# Altium project 7621_Project.PrjPCB
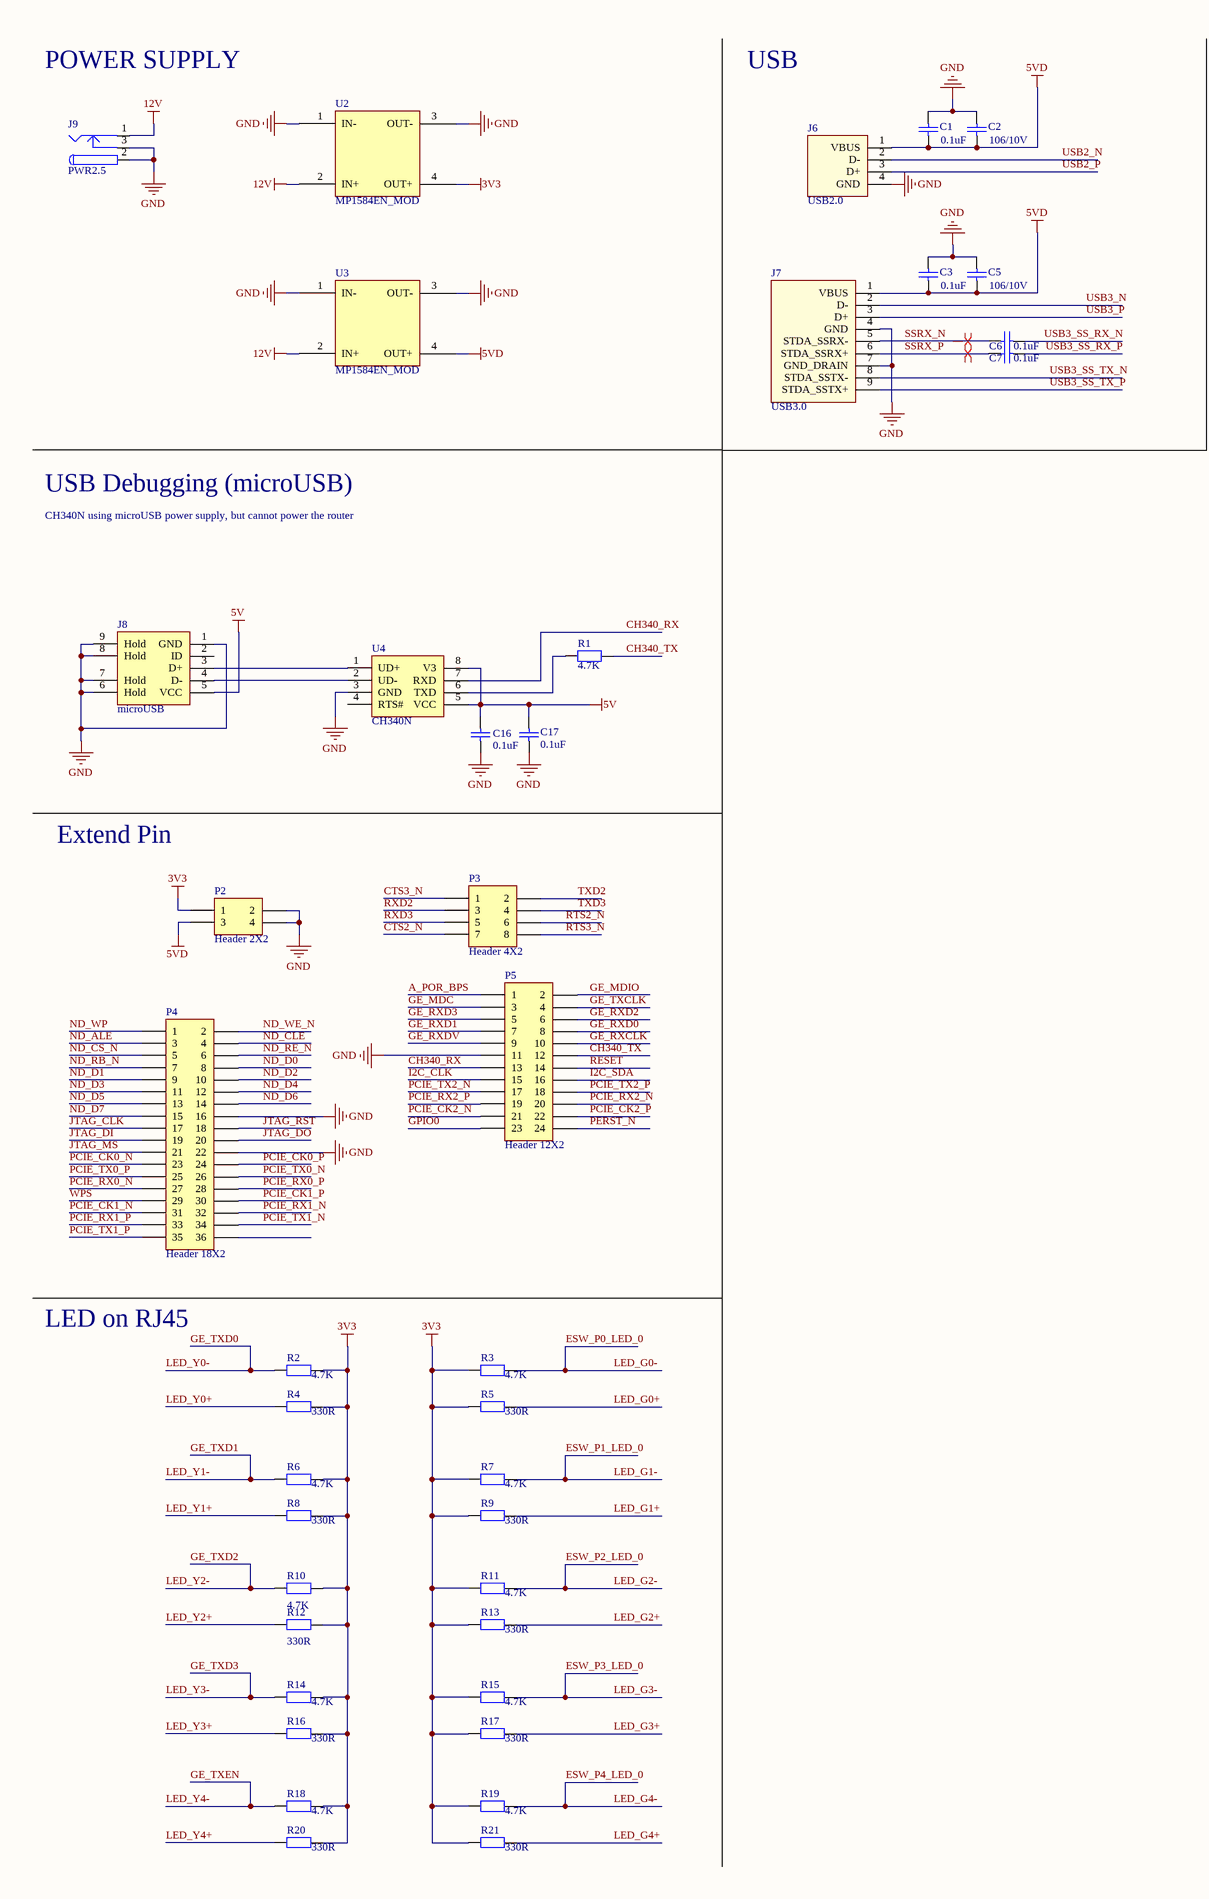
[diagram p0: Sheet.SchDoc, left]
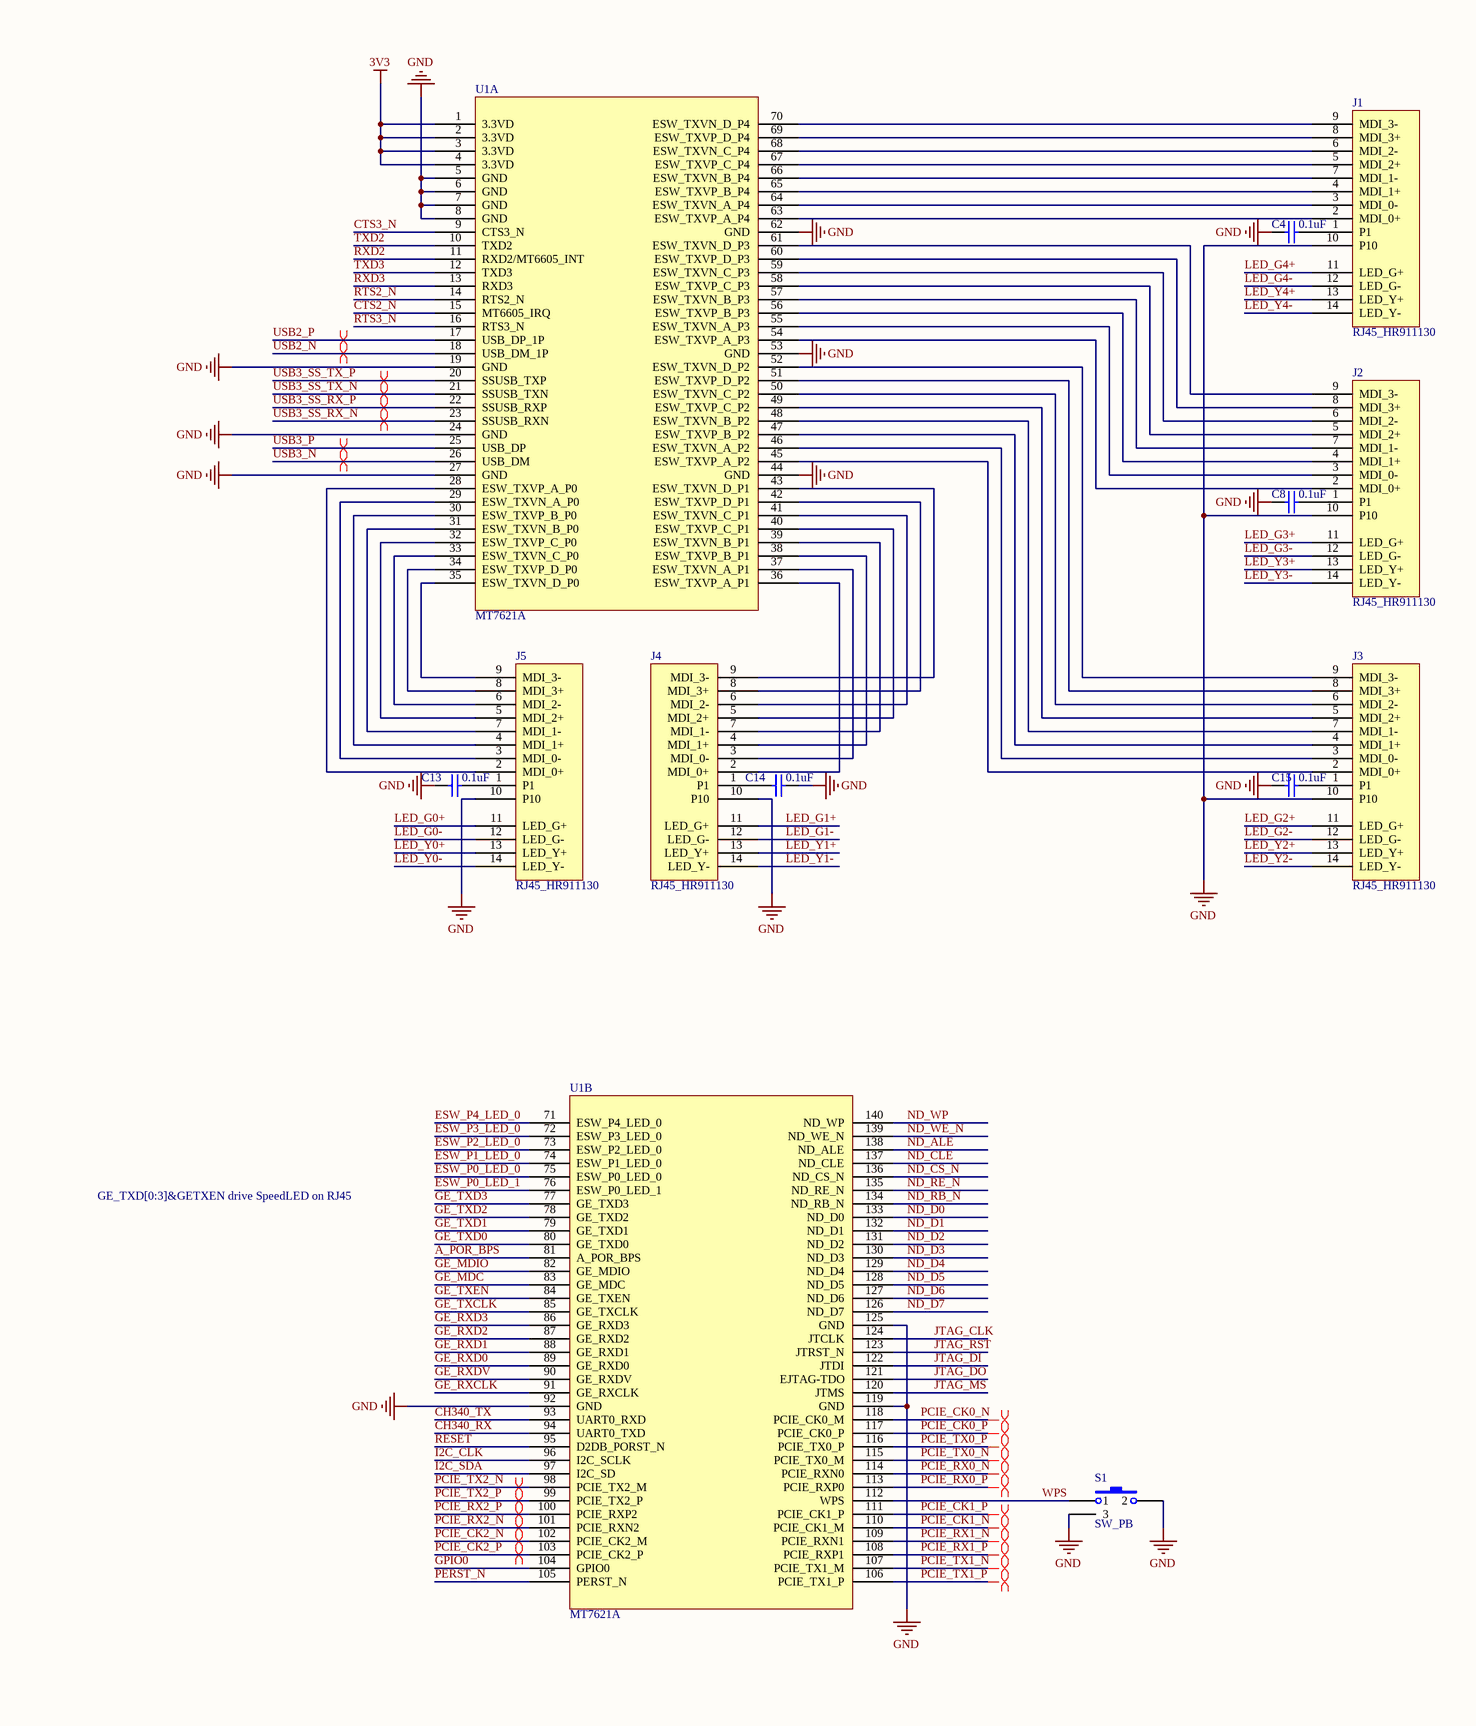
[diagram p1: Sheet.SchDoc, right]
1 sheet, 52 parts. Net scope: global (net labels, ports and power ports of the same name join across sheets).
Board file: PCB.PcbDoc

## Sheet Sheet.SchDoc
size A2

### Parts
C1  value 0.1uF  [6-0805]  (hidden comment: Cap)
C2  value 106/10V  [6-0805]  (hidden comment: Cap)
C3  value 0.1uF  [6-0805]  (hidden comment: Cap)
C4  value 0.1uF  [6-0805]  (hidden comment: Cap)
C5  value 106/10V  [6-0805]  (hidden comment: Cap)
C6  value 0.1uF  [3-0603]  (hidden comment: Cap)
C7  value 0.1uF  [3-0603]  (hidden comment: Cap)
C8  value 0.1uF  [6-0805]  (hidden comment: Cap)
C13  value 0.1uF  [6-0805]  (hidden comment: Cap)
C14  value 0.1uF  [6-0805]  (hidden comment: Cap)
C15  value 0.1uF  [6-0805]  (hidden comment: Cap)
C16  value 0.1uF  [6-0805]  (hidden comment: Cap)
C17  value 0.1uF  [6-0805]  (hidden comment: Cap)
J1  RJ45_HR911130  [RJ45_HR911130]
J2  RJ45_HR911130  [RJ45_HR911130]
J3  RJ45_HR911130  [RJ45_HR911130]
J4  RJ45_HR911130  [RJ45_HR911130]
J5  RJ45_HR911130  [RJ45_HR911130]
J6  USB2.0  [USB2.0]
J7  USB3.0  [USB3.0]
J8  microUSB  [MICROusb]
J9  PWR2.5  [CON\DC-JACK\4.7]
P2  Header 2X2  [HDR2X2]
P3  Header 4X2  [HDR2X4]
P4  Header 18X2  [HDR2X18]
P5  Header 12X2  [HDR2X12]
R1  value 4.7K  [6-0805]  (hidden comment: Res2)
R2  value 4.7K  [6-0805]  (hidden comment: Res2)
R3  value 4.7K  [6-0805]  (hidden comment: Res2)
R4  value 330R  [6-0805]  (hidden comment: Res2)
R5  value 330R  [6-0805]  (hidden comment: Res2)
R6  value 4.7K  [6-0805]  (hidden comment: Res2)
R7  value 4.7K  [6-0805]  (hidden comment: Res2)
R8  value 330R  [6-0805]  (hidden comment: Res2)
R9  value 330R  [6-0805]  (hidden comment: Res2)
R10  value 4.7K  [6-0805]  (hidden comment: Res2)
R11  value 4.7K  [6-0805]  (hidden comment: Res2)
R12  value 330R  [6-0805]  (hidden comment: Res2)
R13  value 330R  [6-0805]  (hidden comment: Res2)
R14  value 4.7K  [6-0805]  (hidden comment: Res2)
R15  value 4.7K  [6-0805]  (hidden comment: Res2)
R16  value 330R  [6-0805]  (hidden comment: Res2)
R17  value 330R  [6-0805]  (hidden comment: Res2)
R18  value 4.7K  [6-0805]  (hidden comment: Res2)
R19  value 4.7K  [6-0805]  (hidden comment: Res2)
R20  value 330R  [6-0805]  (hidden comment: Res2)
R21  value 330R  [6-0805]  (hidden comment: Res2)
S1  SW_PB  [SW_PB]
U1  MT7621A  [HLK-7621]  (parts A,B of 2)
U2  MP1584EN_MOD  [MP1584EN_MOD]
U3  MP1584EN_MOD  [MP1584EN_MOD]
U4  CH340N  [CH340N]

### Nets
3V3: P2.1 R2.2 R3.1 R4.2 R5.1 R6.2 R7.1 R8.2 R9.1 R10.2 R11.1 R12.2 R13.1 R14.2 R15.1 R16.2 R17.1 R18.2 R19.1 R20.2 R21.1 U1.1(3.3VD) U1.2(3.3VD) U1.3(3.3VD) U1.4(3.3VD) U2.4(OUT+)
5V: C16.2 C17.1 J8.5(VCC) U4.5(VCC) U4.8(V3)
5VD: C1.1 C2.1 C3.1 C5.1 J6.1(VBUS) J7.1(VBUS) P2.3 U3.4(OUT+)
12V: J9.1 U2.2(IN+) U3.2(IN+)
GND: C1.2 C2.2 C3.2 C4.2 C5.2 C8.2 C13.2 C14.1 C15.2 C16.1 C17.2 J1.10(P10) J2.10(P10) J3.10(P10) J4.10(P10) J5.10(P10) J6.4(GND) J7.4(GND) J7.7(GND_DRAIN) J8.1(GND) J8.6(Hold) J8.7(Hold) J8.8(Hold) J8.9(Hold) J9.2 J9.3 P2.2 P2.4 P4.16 P4.22 P5.11 S1.2 S1.3 U1.5(GND) U1.6(GND) U1.7(GND) U1.8(GND) U1.19(GND) U1.24(GND) U1.27(GND) U1.44(GND) U1.53(GND) U1.62(GND) U1.92(GND) U1.119(GND) U1.125(GND) U2.1(IN-) U2.3(OUT-) U3.1(IN-) U3.3(OUT-) U4.3(GND)
A_POR_BPS: P5.1 U1.81(A_POR_BPS)
CH340_RX: P5.13 U1.94(UART0_TXD) U4.7(RXD)
CH340_TX: P5.12 R1.1 U1.93(UART0_RXD)
CTS2_N: P3.7 U1.15(MT6605_IRQ)
CTS3_N: P3.1 U1.9(CTS3_N)
ESW_P0_LED_0: J5.12(LED_G-) R3.2 U1.75(ESW_P0_LED_0)  [also labelled LED_G0-]
ESW_P0_LED_1: U1.76(ESW_P0_LED_1)
ESW_P1_LED_0: J4.12(LED_G-) R7.2 U1.74(ESW_P1_LED_0)  [also labelled LED_G1-]
ESW_P2_LED_0: J3.12(LED_G-) R11.2 U1.73(ESW_P2_LED_0)  [also labelled LED_G2-]
ESW_P3_LED_0: J2.12(LED_G-) R15.2 U1.72(ESW_P3_LED_0)  [also labelled LED_G3-]
ESW_P4_LED_0: J1.12(LED_G-) R19.2 U1.71(ESW_P4_LED_0)  [also labelled LED_G4-]
GE_MDC: P5.3 U1.83(GE_MDC)
GE_MDIO: P5.2 U1.82(GE_MDIO)
GE_RXCLK: P5.10 U1.91(GE_RXCLK)
GE_RXD0: P5.8 U1.89(GE_RXD0)
GE_RXD1: P5.7 U1.88(GE_RXD1)
GE_RXD2: P5.6 U1.87(GE_RXD2)
GE_RXD3: P5.5 U1.86(GE_RXD3)
GE_RXDV: P5.9 U1.90(GE_RXDV)
GE_TXCLK: P5.4 U1.85(GE_TXCLK)
GE_TXD0: J5.14(LED_Y-) R2.1 U1.80(GE_TXD0)  [also labelled LED_Y0-]
GE_TXD1: J4.14(LED_Y-) R6.1 U1.79(GE_TXD1)  [also labelled LED_Y1-]
GE_TXD2: J3.14(LED_Y-) R10.1 U1.78(GE_TXD2)  [also labelled LED_Y2-]
GE_TXD3: J2.14(LED_Y-) R14.1 U1.77(GE_TXD3)  [also labelled LED_Y3-]
GE_TXEN: J1.14(LED_Y-) R18.1 U1.84(GE_TXEN)  [also labelled LED_Y4-]
GPIO0: P5.23 U1.104(GPIO0)
I2C_CLK: P5.15 U1.96(I2C_SCLK)
I2C_SDA: P5.16 U1.97(I2C_SD)
JTAG_CLK: P4.17 U1.124(JTCLK)
JTAG_DI: P4.19 U1.122(JTDI)
JTAG_DO: P4.20 U1.121(EJTAG-TDO)
JTAG_MS: P4.21 U1.120(JTMS)
JTAG_RST: P4.18 U1.123(JTRST_N)
LED_G0+: J5.11(LED_G+) R5.2
LED_G1+: J4.11(LED_G+) R9.2
LED_G2+: J3.11(LED_G+) R13.2
LED_G3+: J2.11(LED_G+) R17.2
LED_G4+: J1.11(LED_G+) R21.2
LED_Y0+: J5.13(LED_Y+) R4.1
LED_Y1+: J4.13(LED_Y+) R8.1
LED_Y2+: J3.13(LED_Y+) R12.1
LED_Y3+: J2.13(LED_Y+) R16.1
LED_Y4+: J1.13(LED_Y+) R20.1
ND_ALE: P4.3 U1.138(ND_ALE)
ND_CLE: P4.4 U1.137(ND_CLE)
ND_CS_N: P4.5 U1.136(ND_CS_N)
ND_D0: P4.8 U1.133(ND_D0)
ND_D1: P4.9 U1.132(ND_D1)
ND_D2: P4.10 U1.131(ND_D2)
ND_D3: P4.11 U1.130(ND_D3)
ND_D4: P4.12 U1.129(ND_D4)
ND_D5: P4.13 U1.128(ND_D5)
ND_D6: P4.14 U1.127(ND_D6)
ND_D7: P4.15 U1.126(ND_D7)
ND_RB_N: P4.7 U1.134(ND_RB_N)
ND_RE_N: P4.6 U1.135(ND_RE_N)
ND_WE_N: P4.2 U1.139(ND_WE_N)
ND_WP: P4.1 U1.140(ND_WP)
PCIE_CK0_N: P4.23 U1.118(PCIE_CK0_M)
PCIE_CK0_P: P4.24 U1.117(PCIE_CK0_P)
PCIE_CK1_N: P4.31 U1.110(PCIE_CK1_M)
PCIE_CK1_P: P4.30 U1.111(PCIE_CK1_P)
PCIE_CK2_N: P5.21 U1.102(PCIE_CK2_M)
PCIE_CK2_P: P5.22 U1.103(PCIE_CK2_P)
PCIE_RX0_N: P4.27 U1.114(PCIE_RXN0)
PCIE_RX0_P: P4.28 U1.113(PCIE_RXP0)
PCIE_RX1_N: P4.32 U1.109(PCIE_RXN1)
PCIE_RX1_P: P4.33 U1.108(PCIE_RXP1)
PCIE_RX2_N: P5.20 U1.101(PCIE_RXN2)
PCIE_RX2_P: P5.19 U1.100(PCIE_RXP2)
PCIE_TX0_N: P4.26 U1.115(PCIE_TX0_M)
PCIE_TX0_P: P4.25 U1.116(PCIE_TX0_P)
PCIE_TX1_N: P4.34 U1.107(PCIE_TX1_M)
PCIE_TX1_P: P4.35 U1.106(PCIE_TX1_P)
PCIE_TX2_N: P5.17 U1.98(PCIE_TX2_M)
PCIE_TX2_P: P5.18 U1.99(PCIE_TX2_P)
PERST_N: P5.24 U1.105(PERST_N)
RESET: P5.14 U1.95(D2DB_PORST_N)
RTS2_N: P3.6 U1.14(RTS2_N)
RTS3_N: P3.8 U1.16(RTS3_N)
RXD2: P3.3 U1.11(RXD2/MT6605_INT)
RXD3: P3.5 U1.13(RXD3)
SSRX_N: C6.1 J7.5(STDA_SSRX-)
SSRX_P: C7.1 J7.6(STDA_SSRX+)
TXD2: P3.2 U1.10(TXD2)
TXD3: P3.4 U1.12(TXD3)
USB2_N: J6.2(D-) U1.18(USB_DM_1P)
USB2_P: J6.3(D+) U1.17(USB_DP_1P)
USB3_N: J7.2(D-) U1.26(USB_DM)
USB3_P: J7.3(D+) U1.25(USB_DP)
USB3_SS_RX_N: C6.2 U1.23(SSUSB_RXN)
USB3_SS_RX_P: C7.2 U1.22(SSUSB_RXP)
USB3_SS_TX_N: J7.8(STDA_SSTX-) U1.21(SSUSB_TXN)
USB3_SS_TX_P: J7.9(STDA_SSTX+) U1.20(SSUSB_TXP)
WPS: P4.29 S1.1 U1.112(WPS)
NetC4_1: C4.1 J1.1(P1)
NetC8_1: C8.1 J2.1(P1)
NetC13_1: C13.1 J5.1(P1)
NetC14_2: C14.2 J4.1(P1)
NetC15_1: C15.1 J3.1(P1)
NetJ1_2: J1.2(MDI_0+) U1.63(ESW_TXVP_A_P4)
NetJ1_3: J1.3(MDI_0-) U1.64(ESW_TXVN_A_P4)
NetJ1_4: J1.4(MDI_1+) U1.65(ESW_TXVP_B_P4)
NetJ1_5: J1.5(MDI_2+) U1.67(ESW_TXVP_C_P4)
NetJ1_6: J1.6(MDI_2-) U1.68(ESW_TXVN_C_P4)
NetJ1_7: J1.7(MDI_1-) U1.66(ESW_TXVN_B_P4)
NetJ1_8: J1.8(MDI_3+) U1.69(ESW_TXVP_D_P4)
NetJ1_9: J1.9(MDI_3-) U1.70(ESW_TXVN_D_P4)
NetJ2_2: J2.2(MDI_0+) U1.54(ESW_TXVP_A_P3)
NetJ2_3: J2.3(MDI_0-) U1.55(ESW_TXVN_A_P3)
NetJ2_4: J2.4(MDI_1+) U1.56(ESW_TXVP_B_P3)
NetJ2_5: J2.5(MDI_2+) U1.58(ESW_TXVP_C_P3)
NetJ2_6: J2.6(MDI_2-) U1.59(ESW_TXVN_C_P3)
NetJ2_7: J2.7(MDI_1-) U1.57(ESW_TXVN_B_P3)
NetJ2_8: J2.8(MDI_3+) U1.60(ESW_TXVP_D_P3)
NetJ2_9: J2.9(MDI_3-) U1.61(ESW_TXVN_D_P3)
NetJ3_2: J3.2(MDI_0+) U1.45(ESW_TXVP_A_P2)
NetJ3_3: J3.3(MDI_0-) U1.46(ESW_TXVN_A_P2)
NetJ3_4: J3.4(MDI_1+) U1.47(ESW_TXVP_B_P2)
NetJ3_5: J3.5(MDI_2+) U1.49(ESW_TXVP_C_P2)
NetJ3_6: J3.6(MDI_2-) U1.50(ESW_TXVN_C_P2)
NetJ3_7: J3.7(MDI_1-) U1.48(ESW_TXVN_B_P2)
NetJ3_8: J3.8(MDI_3+) U1.51(ESW_TXVP_D_P2)
NetJ3_9: J3.9(MDI_3-) U1.52(ESW_TXVN_D_P2)
NetJ4_2: J4.2(MDI_0+) U1.36(ESW_TXVP_A_P1)
NetJ4_3: J4.3(MDI_0-) U1.37(ESW_TXVN_A_P1)
NetJ4_4: J4.4(MDI_1+) U1.38(ESW_TXVP_B_P1)
NetJ4_5: J4.5(MDI_2+) U1.40(ESW_TXVP_C_P1)
NetJ4_6: J4.6(MDI_2-) U1.41(ESW_TXVN_C_P1)
NetJ4_7: J4.7(MDI_1-) U1.39(ESW_TXVN_B_P1)
NetJ4_8: J4.8(MDI_3+) U1.42(ESW_TXVP_D_P1)
NetJ4_9: J4.9(MDI_3-) U1.43(ESW_TXVN_D_P1)
NetJ5_2: J5.2(MDI_0+) U1.28(ESW_TXVP_A_P0)
NetJ5_3: J5.3(MDI_0-) U1.29(ESW_TXVN_A_P0)
NetJ5_4: J5.4(MDI_1+) U1.30(ESW_TXVP_B_P0)
NetJ5_5: J5.5(MDI_2+) U1.32(ESW_TXVP_C_P0)
NetJ5_6: J5.6(MDI_2-) U1.33(ESW_TXVN_C_P0)
NetJ5_7: J5.7(MDI_1-) U1.31(ESW_TXVN_B_P0)
NetJ5_8: J5.8(MDI_3+) U1.34(ESW_TXVP_D_P0)
NetJ5_9: J5.9(MDI_3-) U1.35(ESW_TXVN_D_P0)
NetJ8_3: J8.3(D+) U4.1(UD+)
NetJ8_4: J8.4(D-) U4.2(UD-)
NetR1_2: R1.2 U4.6(TXD)

Not connected (* = marked no-connect by the designer): J8 2(ID); P4 36; U4 4(RTS#)

### Layout directives
differential pair: PCIE_CK0_N, PCIE_CK0_P, PCIE_CK1_N, PCIE_CK1_P, PCIE_CK2_N, PCIE_CK2_P, PCIE_RX0_N, PCIE_RX0_P, PCIE_RX1_N, PCIE_RX1_P, PCIE_RX2_N, PCIE_RX2_P, PCIE_TX0_N, PCIE_TX0_P, PCIE_TX1_N, PCIE_TX1_P, PCIE_TX2_N, PCIE_TX2_P, SSRX_N, SSRX_P, USB2_N, USB2_P, USB3_N, USB3_P, USB3_SS_RX_N, USB3_SS_RX_P, USB3_SS_TX_N, USB3_SS_TX_P

### Notes on the sheet
- POWER SUPPLY
- USB
- USB Debugging (microUSB)
- CH340N using microUSB power supply, but cannot power the router
- Extend Pin
- GE_TXD[0:3]&GETXEN drive SpeedLED on RJ45
- LED on RJ45

### Library data of the parts
C1-C8 C13-C17 = Cap: Capacitor; Published: 8-Jun-2000; LatestRevisionDate: 17-Jul-2002; LatestRevisionNote: Re-released for DXP Platform.; PackageReference: RAD-0.3; Publisher: Altium Limited; PackageDescription: Radial Cap, Thru-Hole; 2 Leads; 0.3 in Pin Spacing
P2 = Header 2X2: Header, 2-Pin, Dual row; LatestRevisionDate: 17-Jul-2002; LatestRevisionNote: Re-released for DXP Platform.; Publisher: Altium Limited
P3 = Header 4X2: Header, 4-Pin, Dual row; LatestRevisionDate: 17-Jul-2002; LatestRevisionNote: Re-released for DXP Platform.; Publisher: Altium Limited
P4 = Header 18X2: Header, 18-Pin, Dual row; LatestRevisionDate: 17-Jul-2002; LatestRevisionNote: Re-released for DXP Platform.; Publisher: Altium Limited
P5 = Header 12X2: Header, 12-Pin, Dual row; LatestRevisionDate: 17-Jul-2002; LatestRevisionNote: Re-released for DXP Platform.; Publisher: Altium Limited
R1-R21 = Res2: Resistor; Published: 8-Jun-2000; LatestRevisionDate: 17-Jul-2002; LatestRevisionNote: Re-released for DXP Platform.; PackageReference: AXIAL-0.4; Publisher: Altium Limited; PackageDescription: Axial Device, Thru-Hole; 2 Leads; 0.4 in Pin Spacing